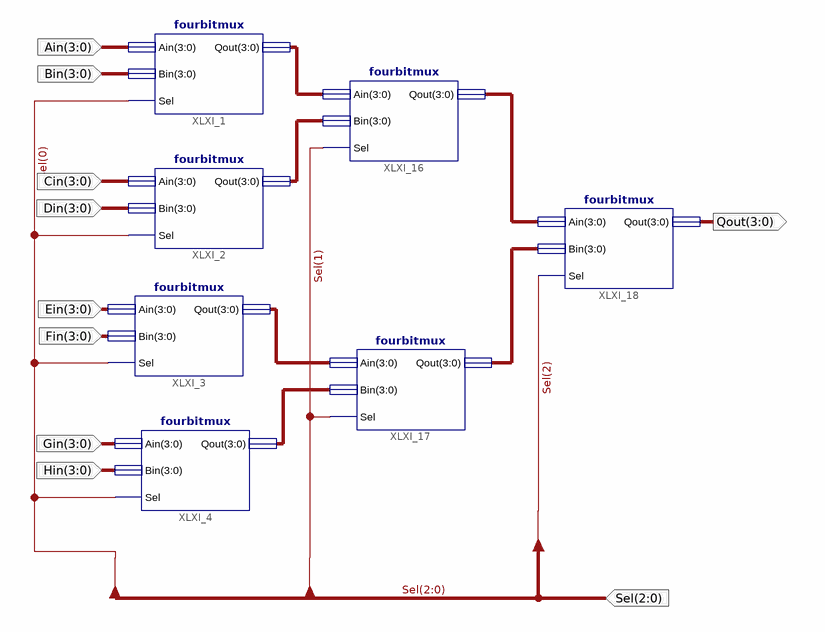
[diagram p0: schematic sheet 1]
// Xilinx ISE schematic eightbitmux.sch (spartan3e) as structural Verilog: 7 symbols, 10 ports
module eightbitmux (
  input  [3:0] Ain,
  input  [3:0] Bin,
  input  [3:0] Cin,
  input  [3:0] Fin,
  input  [3:0] Din,
  input  [3:0] Hin,
  input  [3:0] Ein,
  input  [3:0] Gin,
  input  [2:0] Sel,
  output [3:0] Qout
);

  wire [3:0] XLXN_134, XLXN_135, XLXN_136, XLXN_137, XLXN_172, XLXN_173;

  fourbitmux XLXI_1 (.Ain(Ain), .Bin(Bin), .Sel(Sel[0]), .Qout(XLXN_134));
  fourbitmux XLXI_2 (.Ain(Cin), .Bin(Din), .Sel(Sel[0]), .Qout(XLXN_135));
  fourbitmux XLXI_3 (.Ain(Ein), .Bin(Fin), .Sel(Sel[0]), .Qout(XLXN_136));
  fourbitmux XLXI_16 (.Ain(XLXN_134), .Bin(XLXN_135), .Sel(Sel[1]), .Qout(XLXN_172));
  fourbitmux XLXI_17 (.Ain(XLXN_136), .Bin(XLXN_137), .Sel(Sel[1]), .Qout(XLXN_173));
  fourbitmux XLXI_18 (.Ain(XLXN_172), .Bin(XLXN_173), .Sel(Sel[2]), .Qout(Qout));
  fourbitmux XLXI_4 (.Ain(Gin), .Bin(Hin), .Sel(Sel[0]), .Qout(XLXN_137));
endmodule
